# Altium schematic sheet OTH002.SchDoc
size A4
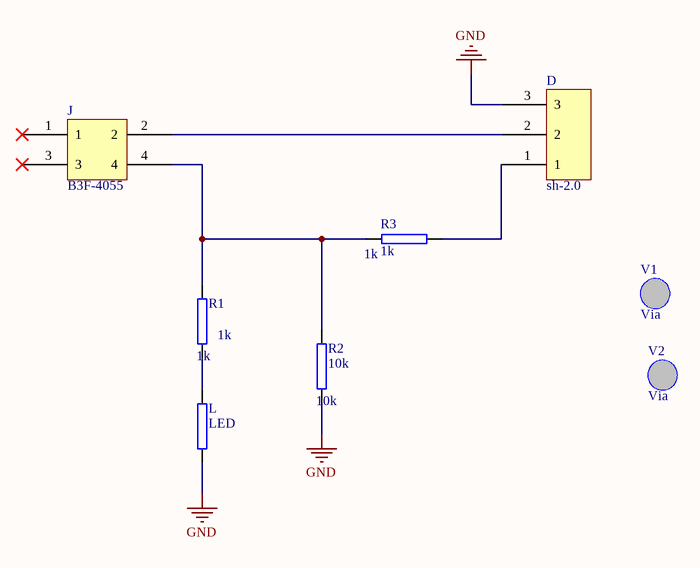
[diagram p0: OTH002.SchDoc]

## Parts
D  sh-2.0  [sh-2.0]
J  B3F-4055  [B3F]
L  LED  [0402]
R1  1k  [0402]
R2  10k  [0402]
R3  1k  [0402]
V1  Via  [Via]
V2  Via  [Via]

## Nets
GND: D.3 L.1 R2.1
NetD_1: D.1 R3.2
NetD_2: D.2 J.2
NetJ_4: J.4 R1.2 R2.2 R3.1
NetL_2: L.2 R1.1

Not connected (* = marked no-connect by the designer): J 1* 3*

## Library data of the parts
L R1-R3 = RES0402